# Altium schematic sheet CPU Clock.SchDoc: CPU Clock
size A4; Date: Dec. 27th, 2022; Author: Karl Asseily; DrawnBy: Karl Asseily; DocumentNumber: 202301222126; Revision: 1.2; SheetNumber: 12; SheetTotal: 20
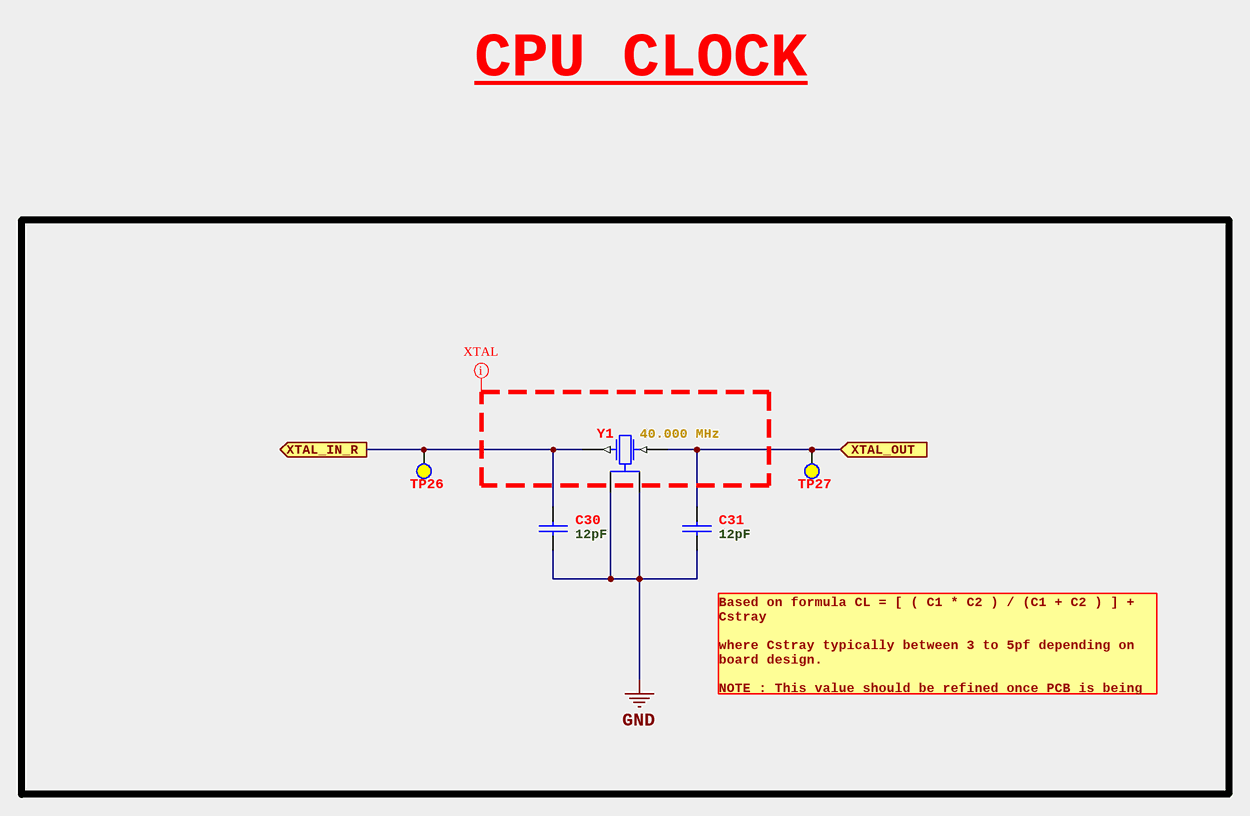
[diagram p0: CPU Clock.SchDoc]

## Parts
C30  12pF  [CAP_0603]
C31  12pF  [CAP_0603]
TP26  CPU 40MHz IN  [TEST POINT HOLE]  (value not drawn)  (no BOM)
TP27  CPU 40MHz OUT  [TEST POINT HOLE]  (value not drawn)  (no BOM)
Y1  Frequency: 40.000 MHz  [XTAL_ECS-400-10-37B2]  (hidden comment: ECS-400-10-37B2-CKY-TR)

## Ports
XTAL_IN_R (out, see Main Controller Unit, ESP32 Processor), XTAL_OUT (in, see Main Controller Unit, ESP32 Processor)

## Nets
GND: C30.2 C31.2 Y1.2(GND) Y1.4(GND)
XTAL_IN_R: C30.1 TP26.TP Y1.1(In/Out) ; port XTAL_IN_R
XTAL_OUT: C31.1 TP27.TP Y1.3(Out/In) ; port XTAL_OUT

## Layout directives
net class XTAL; rule Maximum Via Count Constraint [Max Count = 0]: (no net found under the mark)

## Notes on the sheet
- CPU CLOCK
- Based on formula CL = [ ( C1 * C2 ) / (C1 + C2 ) ] + Cstray
  where Cstray typically between 3 to 5pf depending on board design.
  NOTE : This value should be refined once PCB is being designed
- Project
- Sheet
- Size
- Filename
- A4
- of
- Number
- Drawn By
- Rev.
- Variant
- Date

## Library data of the parts
C30 C31 = CAP_12pf-50V-5%_0603: 12 pF ±5% 50V Ceramic Capacitor C0G, NP0 0603 (1608 Metric); Manufacturer: Yageo; Manufacturer Part Number: CC0603JRNPO9BN120; Insulation Resistance: 100GR; Supplier 1: Digi-Key; RoHS: Yes; Category: Ceramic Capacitors; Stock 1: 152407; Pricing 1: 1=0.10000, 10=0.05100, 50=0.02800, 100=0.02280, 500=0.01630, 1000=0.01280 (USD); Mounting Technology: Surface Mount; Case/Package: 0603; Pins: 2; Case Code (Metric): 1608; Case Code (Imperial): 0603; Dielectric Material: Ceramic; Min Operating Temperature: -55°C; Max Operating Temperature: 125°C; Package Quantity: 1; Capacitance: 12pF; Voltage Rating: 50V; Tolerance: 5%; Packaging: Tape and Reel; Voltage Rating (DC): 50V; Dielectric: C0G; Termination: SMD/SMT; Resistor Type: Ceramic; Series: CC; Length: 1.6mm; Width: 0.031inch; Height: 0.8mm; Thickness: 0.035inch; Depth: 0.8mm; Radiation Hardening: No; Reach SVHC Compliant: Yes; Lead Free: Lead Free; RoHS Compliant: Yes; ComponentLink7URL: C:\Users\Public\Documents\Altium\Projects\Cellar_Watchdog\Docs\Capacitor\UPY-GP_NP0_16V-to-50V_18.pdf; ComponentLink7Description: Datasheet; Supplier 2: Mouser; Supplier Part Number 1: 311-1059-1-ND; Supplier Part Number 2: 603-CC603JRNPO9BN120
TP26 TP27 = Test Point: PCB Test Point; ClassName: Test Point
  TP26: Value: CPU 40MHz IN
  TP27: Value: CPU 40MHz OUT
Y1 = XTAL_40.000MHz-10pF_4-SMD: 40 MHz ±10ppm Crystal 10pF 40 Ohms 4-SMD, No Lead; Manufacturer: ECS International; Supplier 1: Digi-Key; Manufacturer Part Number: ECS-400-10-37B2-CKY-TR; RoHS: No; Category: Uncategorized; Stock 1: 33639; Pricing 1: 1=0.45000, 10=0.37900, 50=0.34080, 100=0.30300, 500=0.28784, 1000=0.24240 (USD); Supplier 2: Mouser; Supplier Part Number 2: 520-400-10-37B2CKYTR; Supplier Part Number 1: 50-ECS-400-10-37B2-CKY-TRCT-ND; ComponentLink1Description: Datasheet; ComponentLink1URL: C:\Users\Public\Documents\Altium\Projects\Cellar_Watchdog\Docs\Crystal\ECX-1637B2.pdf